# EAGLE schematic main (EAGLE 7.7.0)
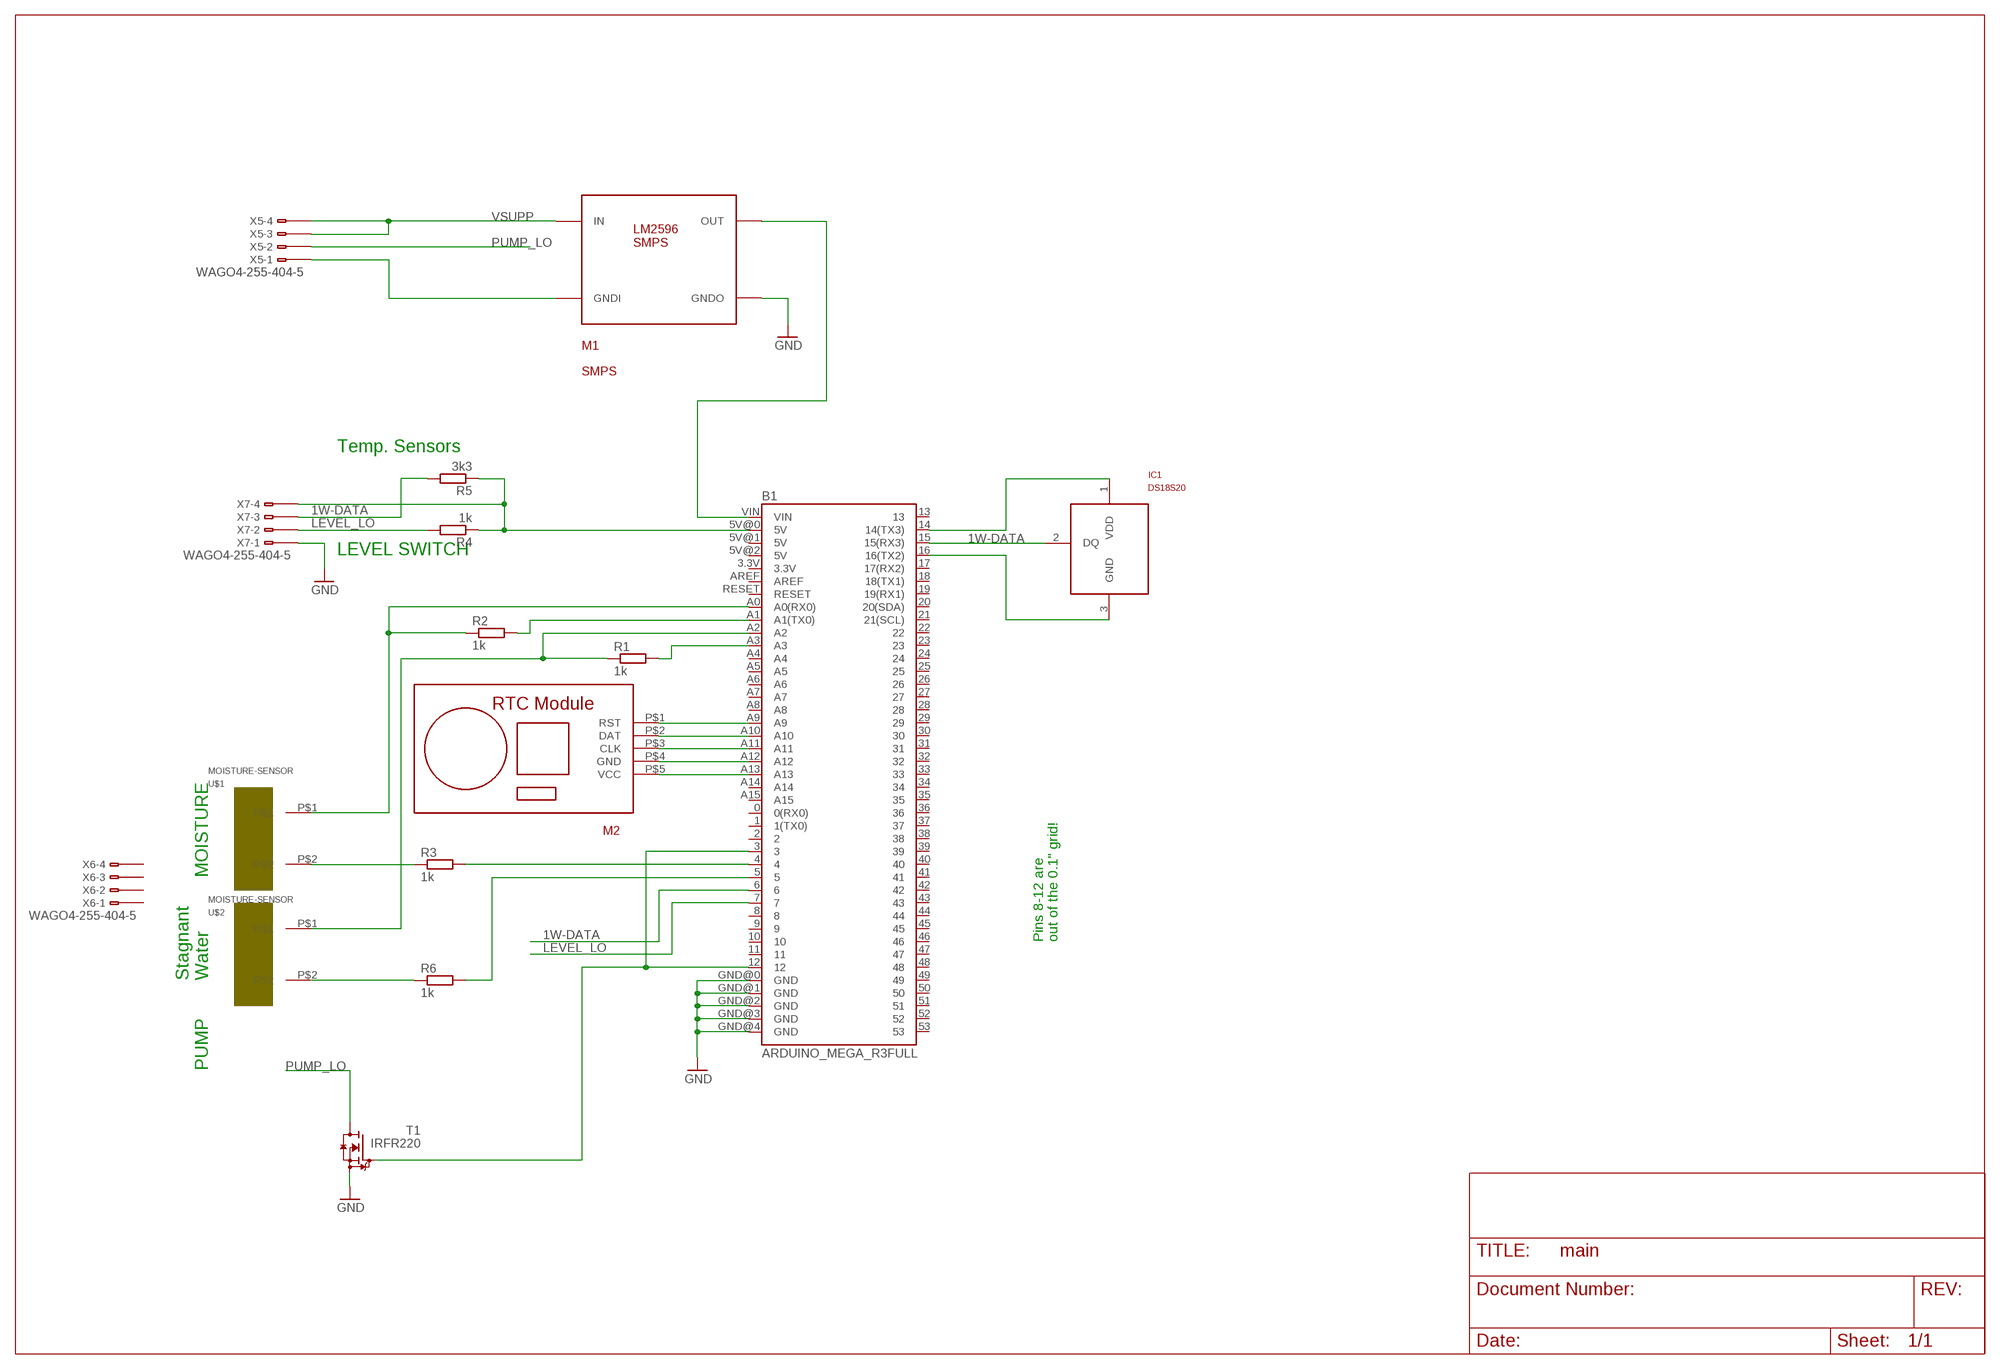
[diagram p0: schematic, sheet 1]

## Parts
B1  ARDUINO_MEGA_R3FULL  [ARDUINO_MEGA]
IC1  DS18S20  DS1820  [TO92-]
M1  SMPS  [SMPS-1]
M2  DS1302-MODULE  [DS1302-MOD]
R1  1k  R-EU_R0805  [R0805]
R2  1k  R-EU_R0805  [R0805]
R3  1k  R-EU_R0805  [R0805]
R4  1k  R-EU_R0805  [R0805]
R5  3k3  R-EU_R0805  [R0805]
R6  1k  R-EU_R0805  [R0805]
T1  IRFR220  [TO252]
U$1  MOISTURE-SENSOR  [MOISTURE-SENSOR]
U$2  MOISTURE-SENSOR  [MOISTURE-SENSOR]
X5  WAGO4-255-404-5  [255-404-5]
X6  WAGO4-255-404-5  [255-404-5]
X7  WAGO4-255-404-5  [255-404-5]

## Nets
1W-DATA: B1.6 B1.15(15(RX3)) IC1.2(DQ) R5.2 X7.B3(-3:B1)
GND: B1.GND@0(GND) B1.GND@1(GND) B1.GND@2(GND) B1.GND@3(GND) B1.GND@4(GND) M1.P$5(GNDO) M1.P$6(GNDO) T1.2(S) X7.B1(-1:B1)
LEVEL_LO: B1.7 R4.2 X7.B2(-2:B1)
N$1: B1.5 R6.2
N$2: M1.P$1(GNDI) M1.P$2(GNDI) X5.B1(-1:B1)
N$3: R6.1 U$2.P$2
N$4: B1.14(14(TX3)) IC1.1(VDD)
N$5: B1.16(16(TX2)) IC1.3(GND)
N$6: R3.1 U$1.P$2
N$7: B1.A0(A0(RX0)) R2.1 U$1.P$1
N$8: B1.A2 R1.1 U$2.P$1
N$9: B1.A1(A1(TX0)) R2.2
N$10: B1.VIN M1.P$7(OUT) M1.P$8(OUT)
N$11: B1.3 B1.12 T1.1(G)
N$13: B1.5V@0(5V) R4.1 R5.1 X7.B4(-4:B1)
N$14: B1.A9 M2.P$1(RST)
N$15: B1.A10 M2.P$2(DAT)
N$16: B1.A11 M2.P$3(CLK)
N$17: B1.A12 M2.P$4(GND)
N$18: B1.A13 M2.P$5(VCC)
N$19: B1.A3 R1.2
N$20: B1.4 R3.2
PUMP_LO: T1.3(D) X5.B2(-2:B1)
VSUPP: M1.P$3(IN) M1.P$4(IN) X5.B3(-3:B1) X5.B4(-4:B1)
Unconnected: B1.0(0(RX0)) B1.1(1(TX0)) B1.2 B1.3.3V B1.5V@1(5V) B1.5V@2(5V) B1.8 B1.9 B1.10 B1.11 B1.13 B1.17(17(RX2)) B1.18(18(TX1)) B1.19(19(RX1)) B1.20(20(SDA)) B1.21(21(SCL)) B1.22 B1.23 B1.24 B1.25 B1.26 B1.27 B1.28 B1.29 B1.30 B1.31 B1.32 B1.33 B1.34 B1.35 B1.36 B1.37 B1.38 B1.39 B1.40 B1.41 B1.42 B1.43 B1.44 B1.45 B1.46 B1.47 B1.48 B1.49 B1.50 B1.51 B1.52 B1.53 B1.A4 B1.A5 B1.A6 B1.A7 B1.A8 B1.A14 B1.A15 B1.AREF B1.RESET X5.A1(-1:A1) X5.A2(-2:A1) X5.A3(-3:A1) X5.A4(-4:A1) X6.A1(-1:A1) X6.A2(-2:A1) X6.A3(-3:A1) X6.A4(-4:A1) X6.B1(-1:B1) X6.B2(-2:B1) X6.B3(-3:B1) X6.B4(-4:B1) X7.A1(-1:A1) X7.A2(-2:A1) X7.A3(-3:A1) X7.A4(-4:A1)

## Notes on the sheet
- Temp. Sensors
- LEVEL SWITCH
- MOISTURE
- Pins 8-12 are
  out of the 0.1" grid!
- Stagnant
  Water
- PUMP

## Library data of the parts
B1 = SparkFun-Boards:ARDUINO_MEGA_R3: Arduino Mega R3 ATmega2560 R3 compatible footprint. SparkFun Products: Arduino Mega 2560 R3 <https://www.sparkfun.com/products/11061>
IC1 = papp:DS1820: DS1820 1 wire temperature sensor
M1 = papp:SMPS
M2 = papp:DS1302-MODULE
R1-R6 = rcl:R-EU_: RESISTOR, European symbol
T1 = papp:IRFR220
U$1 U$2 = plant:MOISTURE-SENSOR
X5-X7 = con-wago:WAGO4-: WAGO Cage Clamp; MPN: 255-404; OC_FARNELL: unknown; OC_NEWARK: 28K9768